# Altium schematic sheet Moving_balls.SchDoc
size A
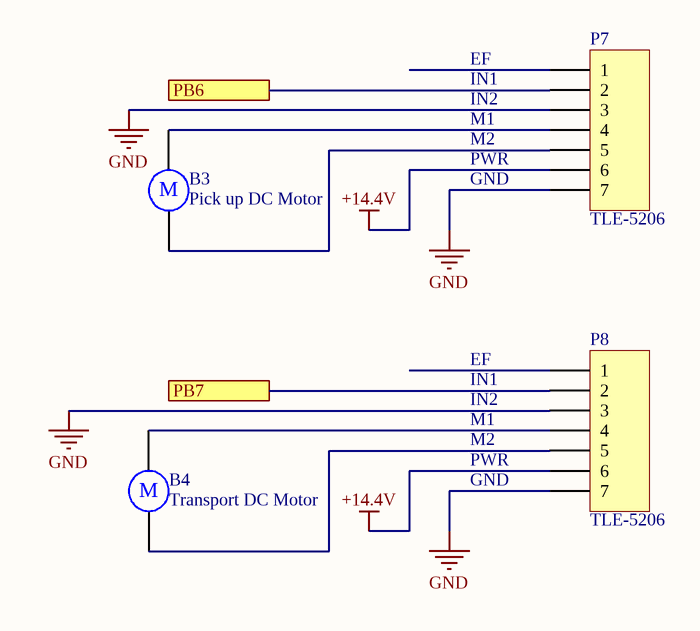
[diagram p0: Moving_balls.SchDoc]

## Parts
B3  Pick up DC Motor  [RB5-10.5]
B4  Transport DC Motor  [RB5-10.5]
P7  TLE-5206  [HDR1X7]
P8  TLE-5206  [HDR1X7]

## Ports
PB6, PB7

## Nets
+14.4V: P7.6 P8.6
GND: P7.3 P7.7 P8.3 P8.7
PB6: P7.2 ; port PB6
PB7: P8.2 ; port PB7
NetB3_1: B3.1 P7.4
NetB3_2: B3.2 P7.5
NetB4_1: B4.1 P8.4
NetB4_2: B4.2 P8.5

Not connected (* = marked no-connect by the designer): P7 1; P8 1

## Notes on the sheet
- EF
- IN1
- IN2
- M1
- M2
- PWR
- GND
- (in symbol Motor) M

## Library data of the parts
B3 B4 = Motor: Motor, General Kind; Manufacturer: Generic Components; Published: 1999
P7 P8 = Header 7: Header, 7-Pin; LatestRevisionDate: 17-Jul-2002; LatestRevisionNote: Re-released for DXP Platform.; Publisher: Altium Limited